# EAGLE design 128 (EAGLE 6.1)
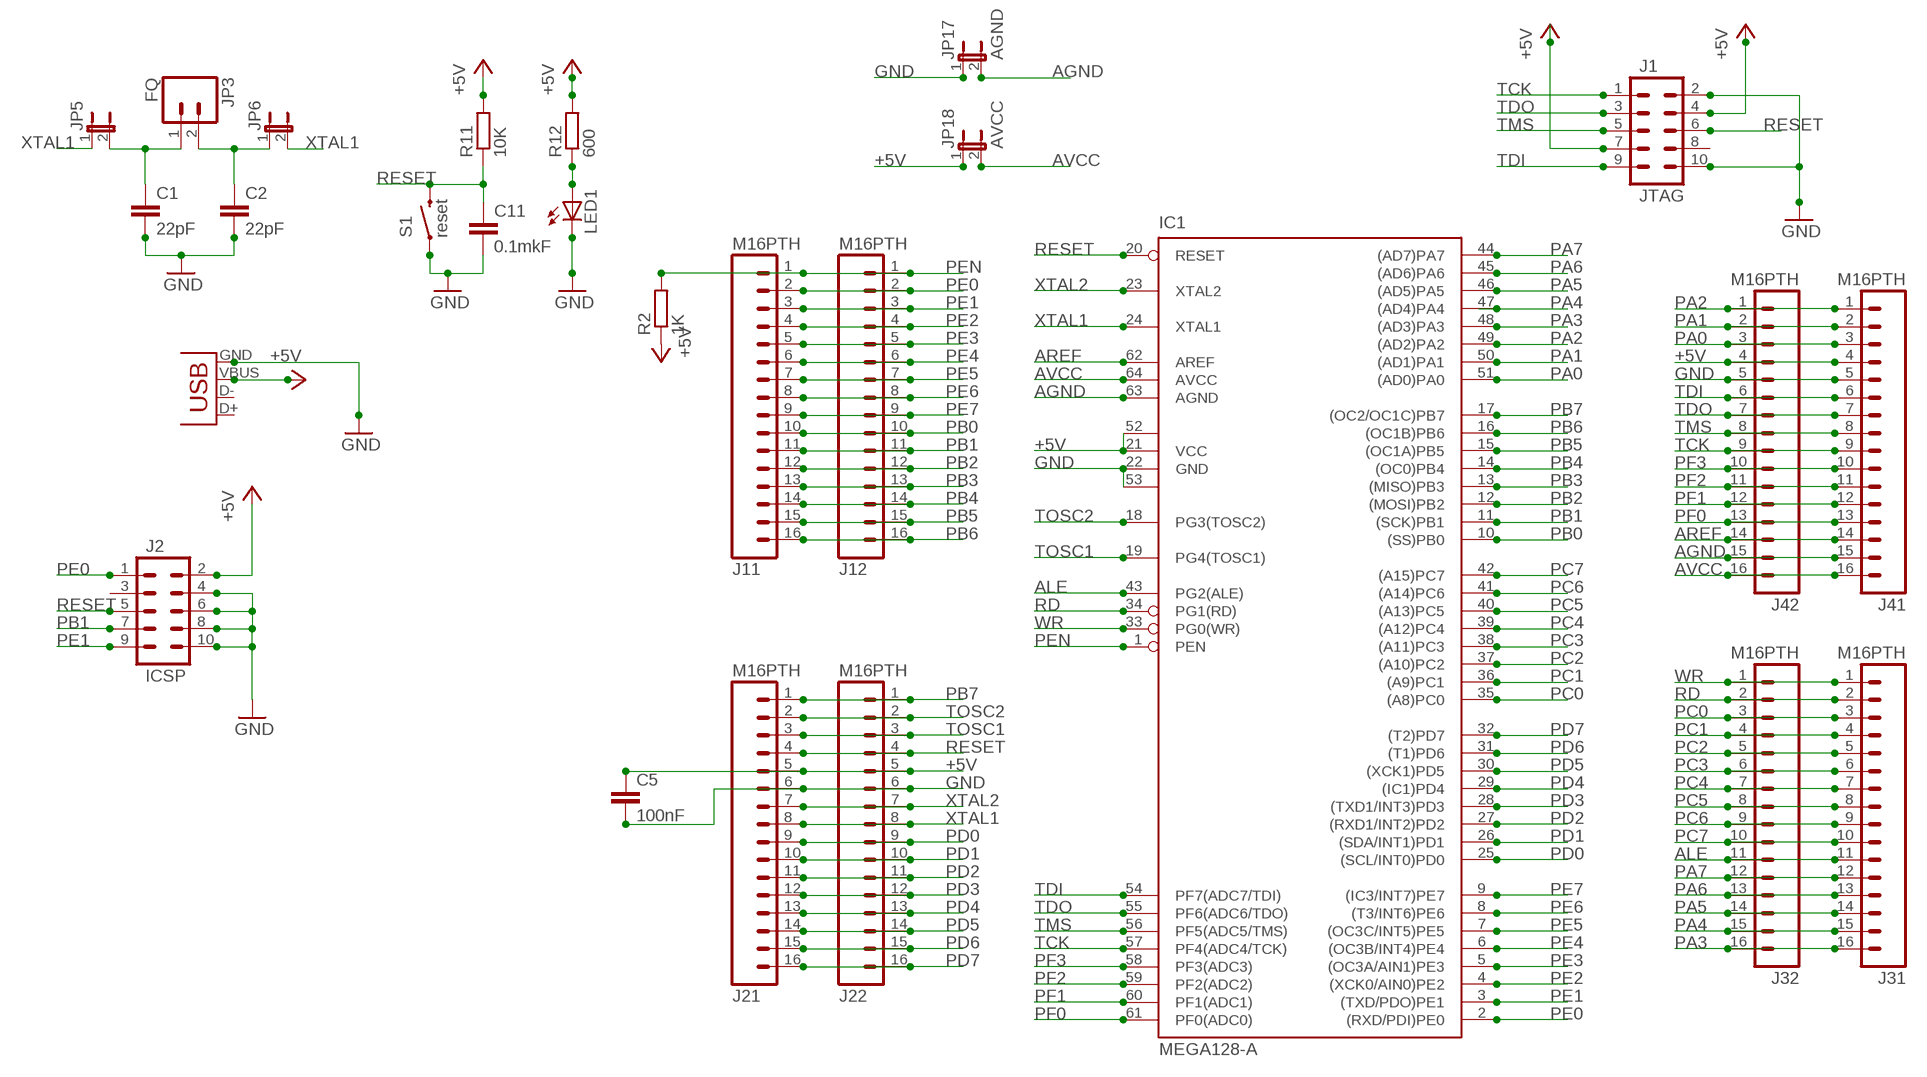
[diagram p0: schematic, sheet 1]

## Parts
C1  22pF  C-EUC0805  [C0805]
C2  22pF  C-EUC0805  [C0805]
C5  100nF  C-EUC0805  [C0805]
C11  0.1mkF  C-EUC0805  [C0805]
IC1  MEGA128-A  [TQFP64]
J1  JTAG  M05X2SHD_LOCK  [2X5-SHROUDED_LOCK]
J2  ICSP  M05X2SHD_LOCK  [2X5-SHROUDED_LOCK]
J11  M16PTH  [1X16]
J12  M16PTH  [1X16]
J21  M16PTH  [1X16]
J22  M16PTH  [1X16]
J31  M16PTH  [1X16]
J32  M16PTH  [1X16]
J41  M16PTH  [1X16]
J42  M16PTH  [1X16]
JP3  FQ  M02LOCK  [1X02_LOCK]
JP4  USBSMD  [USB-MINIB]
JP5  JUMPER-2PTH  [1X02]
JP6  JUMPER-2PTH  [1X02]
JP17  AGND  JUMPER-2PTH  [1X02]
JP18  AVCC  JUMPER-2PTH  [1X02]
LED1  LED1206  [LED-1206]
R2  1K  R-EU_R0805  [R0805]
R11  10K  R-EU_R0805  [R0805]
R12  600  R-EU_R0805  [R0805]
S1  reset  SWITCH-MOMENTARY-2SMD-2  [TACTILE_SWITCH_SMD-2]

## Nets
+5V: C5.1 IC1.21(VCC) IC1.52(VCC1) J1.4 J1.7 J2.2 J21.5 J22.5 J41.4 J42.4 JP4.VBUS JP18.1 R2.1 R11.2 R12.2
AGND: IC1.63(AGND) J41.15 J42.15 JP17.2
ALE: IC1.43(PG2(ALE)) J31.11 J32.11
AREF: IC1.62(AREF) J41.14 J42.14
AVCC: IC1.64(AVCC) J41.16 J42.16 JP18.2
GND: C1.2 C2.2 C5.2 C11.2 IC1.22(GND) IC1.53(GND1) J1.2 J1.10 J2.4 J2.6 J2.8 J2.10 J21.6 J22.6 J41.5 J42.5 JP4.GND JP17.1 LED1.C S1.2
N$65: C1.1 JP3.1 JP5.2
N$66: C2.1 JP3.2 JP6.1
N$67: LED1.A R12.1
PA0: IC1.51((AD0)PA0) J41.3 J42.3
PA1: IC1.50((AD1)PA1) J41.2 J42.2
PA2: IC1.49((AD2)PA2) J41.1 J42.1
PA3: IC1.48((AD3)PA3) J31.16 J32.16
PA4: IC1.47((AD4)PA4) J31.15 J32.15
PA5: IC1.46((AD5)PA5) J31.14 J32.14
PA6: IC1.45((AD6)PA6) J31.13 J32.13
PA7: IC1.44((AD7)PA7) J31.12 J32.12
PB0: IC1.10((SS)PB0) J11.10 J12.10
PB1: IC1.11((SCK)PB1) J2.7 J11.11 J12.11
PB2: IC1.12((MOSI)PB2) J11.12 J12.12
PB3: IC1.13((MISO)PB3) J11.13 J12.13
PB4: IC1.14((OC0)PB4) J11.14 J12.14
PB5: IC1.15((OC1A)PB5) J11.15 J12.15
PB6: IC1.16((OC1B)PB6) J11.16 J12.16
PB7: IC1.17((OC2/OC1C)PB7) J21.1 J22.1
PC0: IC1.35((A8)PC0) J31.3 J32.3
PC1: IC1.36((A9)PC1) J31.4 J32.4
PC2: IC1.37((A10)PC2) J31.5 J32.5
PC3: IC1.38((A11)PC3) J31.6 J32.6
PC4: IC1.39((A12)PC4) J31.7 J32.7
PC5: IC1.40((A13)PC5) J31.8 J32.8
PC6: IC1.41((A14)PC6) J31.9 J32.9
PC7: IC1.42((A15)PC7) J31.10 J32.10
PD0: IC1.25((SCL/INT0)PD0) J21.9 J22.9
PD1: IC1.26((SDA/INT1)PD1) J21.10 J22.10
PD2: IC1.27((RXD1/INT2)PD2) J21.11 J22.11
PD3: IC1.28((TXD1/INT3)PD3) J21.12 J22.12
PD4: IC1.29((IC1)PD4) J21.13 J22.13
PD5: IC1.30((XCK1)PD5) J21.14 J22.14
PD6: IC1.31((T1)PD6) J21.15 J22.15
PD7: IC1.32((T2)PD7) J21.16 J22.16
PE0: IC1.2((RXD/PDI)PE0) J2.1 J11.2 J12.2
PE1: IC1.3((TXD/PDO)PE1) J2.9 J11.3 J12.3
PE2: IC1.4((XCK0/AIN0)PE2) J11.4 J12.4
PE3: IC1.5((OC3A/AIN1)PE3) J11.5 J12.5
PE4: IC1.6((OC3B/INT4)PE4) J11.6 J12.6
PE5: IC1.7((OC3C/INT5)PE5) J11.7 J12.7
PE6: IC1.8((T3/INT6)PE6) J11.8 J12.8
PE7: IC1.9((IC3/INT7)PE7) J11.9 J12.9
PEN: IC1.1(PEN) J11.1 J12.1 R2.2
PF0: IC1.61(PF0(ADC0)) J41.13 J42.13
PF1: IC1.60(PF1(ADC1)) J41.12 J42.12
PF2: IC1.59(PF2(ADC2)) J41.11 J42.11
PF3: IC1.58(PF3(ADC3)) J41.10 J42.10
RD: IC1.34(PG1(RD)) J31.2 J32.2
RESET: C11.1 IC1.20(RESET) J1.6 J2.5 J21.4 J22.4 R11.1 S1.1
TCK: IC1.57(PF4(ADC4/TCK)) J1.1 J41.9 J42.9
TDI: IC1.54(PF7(ADC7/TDI)) J1.9 J41.6 J42.6
TDO: IC1.55(PF6(ADC6/TDO)) J1.3 J41.7 J42.7
TMS: IC1.56(PF5(ADC5/TMS)) J1.5 J41.8 J42.8
TOSC1: IC1.19(PG4(TOSC1)) J21.3 J22.3
TOSC2: IC1.18(PG3(TOSC2)) J21.2 J22.2
WR: IC1.33(PG0(WR)) J31.1 J32.1
XTAL1: IC1.24(XTAL1) J21.8 J22.8 JP5.1 JP6.2
XTAL2: IC1.23(XTAL2) J21.7 J22.7
Unconnected: J1.8 J2.3 JP4.D+ JP4.D-

## Library data of the parts
C1 C2 C5 C11 = resistor:C-EU: CAPACITOR, European symbol
IC1 = avr-6:MEGA128: MICROCONTROLLER 128 Kbytes FLASH 4 Kbytes SRAM 4 Kbytes EEPROM DUAL USART 8-channel 10 bit ADC
J1 J2 = SparkFun-Connectors:M05X2: Header 5x2 Standard 10-pin dual row 0.1" header. Commonly used with AVR-ISP. Use with Spark Fun Electronics SKU: PRT-00778
J11 J12 J21 J22 J31 J32 J41 J42 = SparkFun-Connectors:M16: 1x16 .1" header
JP3 = SparkFun-Connectors:M02: Standard 2-pin 0.1" header. Use with - straight break away headers ( PRT-00116) - right angle break away headers (PRT-00553) - swiss pins (PRT-00743) - machine pins (PRT-00117) - female headers (PRT-00115) Molex polarized connector foot print use with: PRT-08233 with associated crimp pins and housings. 2.54_SCREWTERM for use with PRT-10571. 3.5mm Screw Terminal footprints for PRT-08084 5mm Screw Terminal footprints for use with PRT-08433
JP4 = SparkFun-Connectors:USB: USB Connectors USB-B-PTH is fully proven SKU : PRT-00139/CONN-08278 USB-miniB is fully proven SKU : PRT-00587 USB-A-PCB is untested. USB-A-H is throughly reviewed, but untested. Spark Fun Electronics SKU : PRT-00437 USB-B-SMT is throughly reviewed, but untested. Needs silkscreen touching up. USB-A-S has not been used/tested USB-MB-H has not been used/tested USB-MICROB has been used. CONN-09505; PROD_ID: CONN-08193
JP5 JP6 JP17 JP18 = SparkFun-Passives:JUMPER-2: Jumper Basic 0.1" spaced jumper. Use with breakaway headers.
LED1 = SparkFun-LED:LED: LEDs Standard schematic elements and footprints for 5mm, 3mm, 1206, and 0603 sized LEDs. 5mm - Spark Fun Electronics SKU : COM-00529 (and others)
R2 R11 R12 = resistor:R-EU_: RESISTOR, European symbol
S1 = SparkFun-Electromechanical:SWITCH-MOMENTARY-2: Various NO switches- pushbuttons, reed, etc

## Board
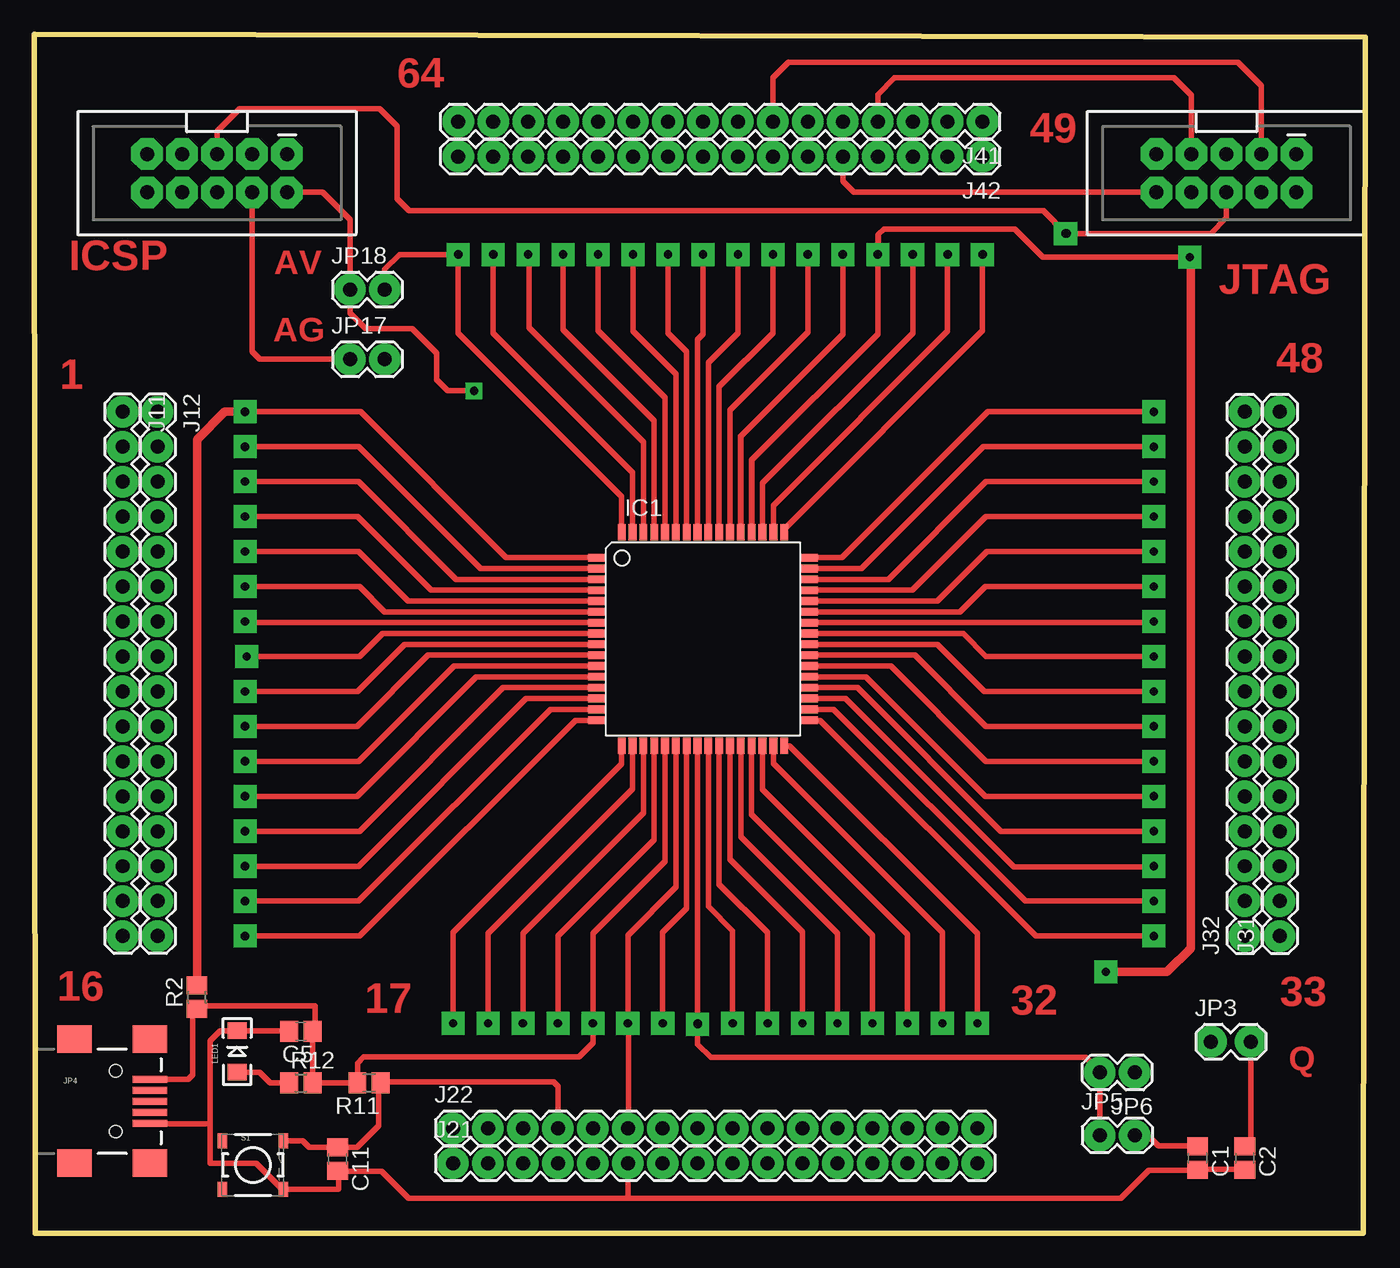
[diagram p1: board, top side]
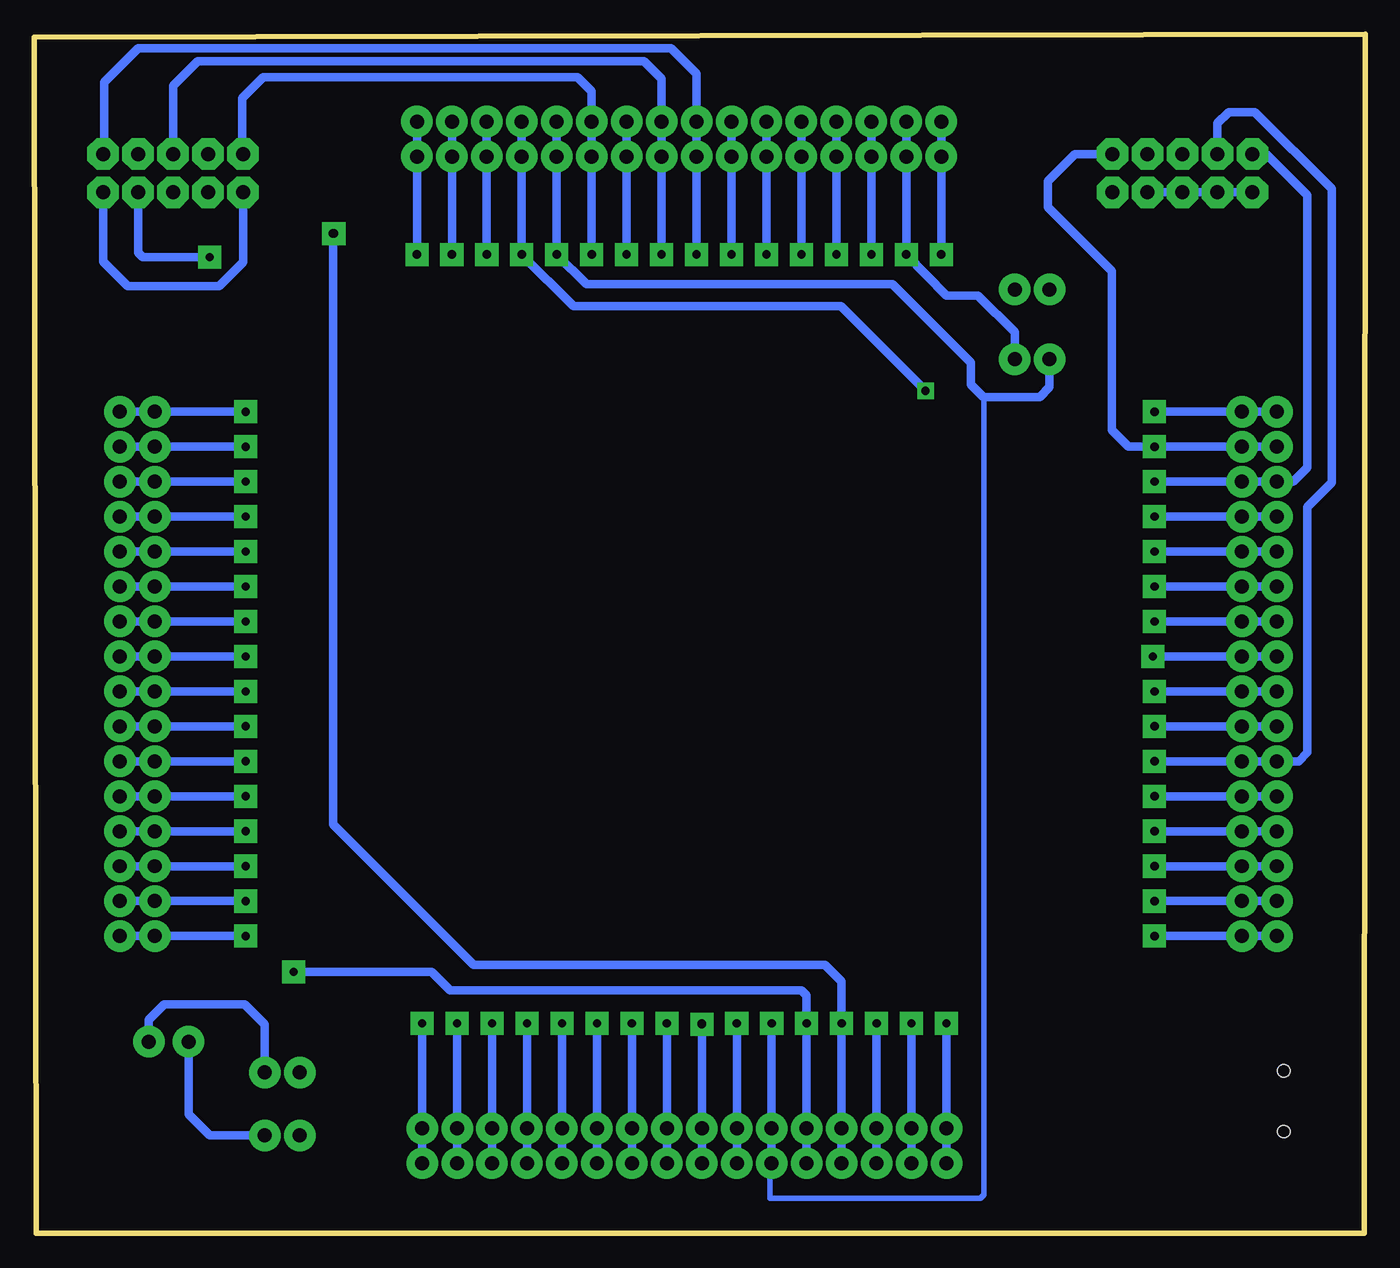
[diagram p2: board, bottom side, seen from below]

Size 96.69 x 87.11 mm. Coordinates in mm from the lower left corner, seen from the top.
Outline: 0.06,0 96.56,0 96.69,86.92 0,87.11 0.06,0
Copper layers (1*16): Top 0.035mm / dielectric 1.5mm / Bottom 0.035mm
Design rules: minimum track width 10mil, minimum drill 12mil, track to track 8mil, track to pad 12mil, pad to pad 12mil, via to via 12mil, smd to smd 8mil, copper to edge 4mil, drill to drill 20mil, minimum pad ring 25mil, minimum via ring 12mil, stop-mask expansion 4mil, vias tented up to drill 0mil, thermal gap 10mil

### Footprints (pad centres in the part's own frame; a part is rotated, then mirrored left to right if it is on the bottom)
C0805 = smd 1.3 x 1.5: 1 -0.85,0; 2 0.85,0
TQFP64 = smd 1.194 x 0.559: 1 -7.76,5.905; 2 -7.76,5.118; 3 -7.76,4.331; 4 -7.76,3.543; 5 -7.76,2.756; 6 -7.76,1.968; 7 -7.76,1.181; 8 -7.76,0.394; 9 -7.76,-0.394; 10 -7.76,-1.181; 11 -7.76,-1.968; 12 -7.76,-2.756; 13 -7.76,-3.543; 14 -7.76,-4.331; 15 -7.76,-5.118; 16 -7.76,-5.905; 33 7.76,-5.905; 34 7.76,-5.118; 35 7.76,-4.331; 36 7.76,-3.543; 37 7.76,-2.756; 38 7.76,-1.968; 39 7.76,-1.181; 40 7.76,-0.394; 41 7.76,0.394; 42 7.76,1.181; 43 7.76,1.968; 44 7.76,2.756; 45 7.76,3.543; 46 7.76,4.331; 47 7.76,5.118; 48 7.76,5.905 | smd 0.559 x 1.194: 17 -5.905,-7.76; 18 -5.118,-7.76; 19 -4.331,-7.76; 20 -3.543,-7.76; 21 -2.756,-7.76; 22 -1.968,-7.76; 23 -1.181,-7.76; 24 -0.394,-7.76; 25 0.394,-7.76; 26 1.181,-7.76; 27 1.968,-7.76; 28 2.756,-7.76; 29 3.543,-7.76; 30 4.331,-7.76; 31 5.118,-7.76; 32 5.905,-7.76; 49 5.905,7.76; 50 5.118,7.76; 51 4.331,7.76; 52 3.543,7.76; 53 2.756,7.76; 54 1.968,7.76; 55 1.181,7.76; 56 0.394,7.76; 57 -0.394,7.76; 58 -1.181,7.76; 59 -1.968,7.76; 60 -2.756,7.76; 61 -3.543,7.76; 62 -4.331,7.76; 63 -5.118,7.76; 64 -5.905,7.76
2X5-SHROUDED_LOCK = drill 1.016 pad 1.88 octagon: 1 -1.397,5.08; 2 1.397,5.08; 3 -1.397,2.54; 4 1.397,2.54; 5 -1.397,0; 6 1.397,0; 7 -1.397,-2.54; 8 1.397,-2.54; 9 -1.397,-5.08; 10 1.397,-5.08
1X16 = drill 1.016 pad 1.88: 1 0,0; 2 2.54,0; 3 5.08,0; 4 7.62,0; 5 10.16,0; 6 12.7,0; 7 15.24,0; 8 17.78,0; 9 20.32,0; 10 22.86,0; 11 25.4,0; 12 27.94,0; 13 30.48,0; 14 33.02,0; 15 35.56,0; 16 38.1,0
1X02_LOCK = drill 1.016 pad 1.88: 1 -0.178,0; 2 2.718,0
USB-MINIB = smd 2.5 x 0.5: D+ 2.5,0; D- 2.5,0.8; GND 2.5,-1.6; ID 2.5,-0.8; VBUS 2.5,1.6 | smd 2.5 x 2: MTN1 -3,4.5; MTN2 2.5,4.5; MTN3 -3,-4.5; MTN4 2.5,-4.5 | hole 0.9: 0,2.2; 0,-2.2
1X02 = drill 1.016 pad 1.88: 1 0,0; 2 2.54,0
LED-1206 = smd 1.2 x 1.4: A -1.5,0; C 1.5,0
R0805 = smd 1.3 x 1.5: 1 -0.85,0; 2 0.85,0
TACTILE_SWITCH_SMD-2 = smd 0.7 x 1.1: 1 2.225,1.75; 2 2.225,-1.75; 3 -2.225,-1.75; 4 -2.225,1.75

### Placement (x,y rotation side)
C1  84.52,5.46 270 top
C2  87.95,5.46 270 top
C5  19.37,14.67 180 top
C11  22.03,5.4 270 top
IC1  48.58,43.18 0 top
J1  86.61,77.03 270 top
J2  13.27,77.03 270 top
J11  6.41,59.69 270 top
J12  8.95,59.69 270 top
J21  30.42,5.08 0 top
J22  30.42,7.62 0 top
J31  90.49,21.59 90 top
J32  87.95,21.59 90 top
J41  68.9,80.77 180 top
J42  68.9,78.23 180 top
JP3  85.66,13.91 0 top
JP4  5.91,9.59 0 top
JP5  77.41,7.11 0 top
JP6  79.95,11.68 180 top
JP17  22.92,63.5 0 top
JP18  22.92,68.58 0 top
LED1  14.73,13.21 90 top
R2  11.81,17.14 90 top
R11  24.32,10.92 180 top
R12  19.37,10.92 0 top
S1  15.88,4.95 0 top

### Tracks (layer width: path | path; a pad name or v marks a point on that pad's centre or on a via)
+5V  (via drill 0.6, 0.6 pad 1.68)
  Top 0.254: 11.49,16.51 R2.1 | 20.38,15.24 C5.1 | 40.7,15.24 v40.58,15.24 | 45.85,35.56 IC1.21 | 52.07,50.74 IC1.52
  Top 0.406: IC1.52 52.12,56.19 52.13,56.2 | 61.28,71.06 v61.28,71.12 61.28,72.52 61.34,72.58 | 20.38,15.24 20.38,16.51 11.49,16.51 11.49,11.49 11.18,11.18 8.42,11.18 JP4.VBUS | C5.1 R12.2 R11.2 23.47,12.36 23.94,12.83 39.56,12.83 40.58,13.84 v40.58,15.24 40.58,21.78 45.82,27.03 IC1.21 | 52.2,50.86 IC1.52 | J2.2 20.96,75.63 22.92,73.66 JP18.1 22.92,66.86 24.07,65.72 27.43,65.72 29.21,63.94 29.21,62.04 30.04,61.21 v31.94,61.21 | J1.7 84.07,82.68 82.8,83.95 62.48,83.95 61.28,82.74 61.28,80.83 J41.4 | 52.13,50.93 IC1.52 | 52.07,50.74 52.07,50.98 52.15,51.05 52.15,51.28 | 52.15,51.36 52.15,51.4 52.11,51.44 52.11,51.32 52.15,51.28 | 52.15,51.28 52.15,51.36 | 52.15,51.36 52.13,51.37 52.13,56.2 | 52.13,56.2 61.28,65.34 61.28,71.06 | 61.28,71.06 61.34,71.12 61.34,72.58 | 61.34,72.58 61.72,72.96 71.25,72.96 73.28,70.93 v83.95,70.93 84.01,70.93
  Top 0.61: 84.01,70.93 84.01,20.7 82.3,18.99 v77.85,18.99 | 61.28,80.83 61.28,78.17 | 40.58,7.68 J21.5
  Bottom 0.61: J21.5 J22.5 v40.58,15.24 40.58,17.27 40.96,17.65 66.48,17.65 67.82,18.99 v77.85,18.99 | J41.4 J42.4 v61.28,71.12 | 61.12,70.96 v61.28,71.12 | v83.95,70.93 88.84,70.93 89.15,71.25 J1.4 | v31.94,61.21 38.1,67.37 57.53,67.37 v61.28,71.12
AGND  (via drill 0.6 pad 1.68)
  Top 0.406: IC1.63 43.46,55.28 33.34,65.41 v33.34,71.12
  Top 0.61: 33.34,78.17 J41.15
  Bottom 0.61: J41.15 J42.15 v33.34,71.12 30.42,68.14 28.13,68.14 25.46,65.47 JP17.2
ALE  (via drill 0.6 pad 1.68)
  Top 0.406: IC1.43 67.25,45.15 69.09,46.99 v81.34,46.99
  Top 0.61: 87.82,46.99 J31.11
  Bottom 0.61: J31.11 J32.11 v81.34,46.99
AREF  (via drill 0.6 pad 1.68)
  Top 0.406: IC1.62 44.25,57.48 35.94,65.79 35.94,71.06 v35.88,71.12
  Bottom 0.61: J41.14 J42.14 v35.88,71.12
AVCC  (via drill 0.6 pad 1.68)
  Top 0.406: IC1.64 42.67,53.53 30.8,65.41 v30.8,71.12 26.54,71.12 25.46,70.04 JP18.2
  Top 0.61: J41.16 30.8,78.17
  Bottom 0.61: J41.16 J42.16 v30.8,71.12
GND  (via drill 0.6 pad 1.68)
  Top 0.254: 85.15,5.08 C1.2 83.88,5.08 | 21.65,5.08 C11.2 | 51.31,50.8 IC1.53 | 12.76,9.72 12.76,9.53
  Top 0.406: 51.33,57.94 IC1.53 51.31,50.91 | 51.33,57.94 58.74,65.34 v58.74,71.12 | 43.12,15.37 v43.12,15.24 | 43.18,2.54 27.18,2.54 25.23,4.48 22.1,4.48 | 43.18,2.54 78.93,2.54 80.96,4.57 84.48,4.57 C1.2 84.54,4.64 87.5,4.64 87.69,4.83 87.95,4.83 C2.2 | C5.2 18.48,14.71 LED1.C 13.5,14.71 12.76,13.97 12.76,9.72 12.76,9.59 | 22.1,4.48 22.1,3.24 22.06,3.2 S1.2 18.14,3.24 18.16,3.24 18.1,3.3 17.97,3.3 17.97,3.24 16.13,5.08 12.76,5.08 12.76,7.94 | 22.1,4.48 C11.2 | J21.6 43.12,2.6 43.18,2.54 | J1.10 59.56,75.63 58.74,76.45 58.74,78.17 J42.5 | J2.4 15.81,64.07 16.38,63.5 JP17.1 | 12.76,7.94 8.51,7.94 8.45,8 8.42,8 JP4.GND | 12.76,7.94 12.76,9.53 | IC1.22 46.61,25.15 43.12,21.65 43.12,15.37 | 43.12,15.37 43.18,15.3 43.18,4.83 | 51.31,50.8 51.31,57.91 51.33,57.94
  Top 0.61: 58.74,80.83 58.74,78.17 | J22.6 J21.6
  Bottom 0.406: 28.64,63.25 28.64,61.66 | v58.74,71.12 58.67,71.12 56.52,68.96 34.42,68.96 34.35,68.9 34.29,68.9 28.58,63.18 28.58,61.59 27.69,60.71 27.69,2.79 27.94,2.54 43.24,2.54 43.24,4.45 43.12,4.57 J21.6
  Bottom 0.61: J21.6 J22.6 v43.12,15.24 | J41.5 J42.5 v58.74,71.12 | J2.4 J2.6 J2.8 J2.10 | J1.10 81.53,70.55 83.25,68.83 89.92,68.83 91.69,70.61 J1.2 | 58.64,71.03 v58.74,71.12 | 28.64,61.72 28.64,63.25 34.35,68.96 56.52,68.96 56.58,68.96 v58.74,71.12 | 28.64,61.66 27.75,60.77 23.62,60.77 22.92,61.47 JP17.1
N$1
  Top 0.61: 6.35,34.29 9.02,34.29
N$2
  Top 0.61: 6.35,57.15 9.02,57.15
N$4
  Top 0.61: 35.88,80.83 35.88,78.17
N$5
  Top 0.61: 38.42,80.83 38.42,78.17
N$6
  Top 0.61: 40.96,80.9 40.96,78.17
N$7
  Top 0.61: 43.5,80.83 43.5,78.17
N$8
  Top 0.61: 48.58,80.83 48.58,78.17
N$9
  Top 0.61: 51.12,80.83 51.12,78.17
N$10
  Top 0.61: 56.2,80.9 56.2,78.17
N$11
  Top 0.61: 63.82,80.83 63.82,78.17
N$12
  Top 0.61: 87.88,24.13 90.55,24.13
N$13
  Top 0.61: 30.42,5.14 30.42,7.68
N$65
  Top 0.406: JP5.2 80.9,7.11 81.66,6.35 84.45,6.35 84.45,6.31 | C1.1 84.45,6.31 | 84.45,6.31 84.45,6.29
  Bottom 0.61: JP3.1 85.48,8.65 83.95,7.11 JP5.2
N$66
  Top 0.406: C2.1 88.1,6.31 88.39,6.6 88.39,13.89 JP3.2
  Bottom 0.61: JP6.1 79.95,15.18 81.41,16.64 87.25,16.64 88.39,15.49 JP3.2
N$67
  Top 0.406: R12.1 17.14,10.92 16.38,11.68 14.8,11.68 | 14.8,11.68 14.6,11.68 | LED1.A 14.77,11.71 14.8,11.68
PA0  (via drill 0.6 pad 1.68)
  Top 0.406: IC1.51 52.91,54.5 63.82,65.41 v63.82,71.12
  Bottom 0.61: J41.3 J42.3 v63.82,71.12
PA1  (via drill 0.6 pad 1.68)
  Top 0.406: IC1.50 53.7,52.87 66.36,65.53 v66.36,71.12
  Top 0.61: J41.2 66.36,78.17
  Bottom 0.61: J41.2 J42.2 v66.36,71.12
PA2  (via drill 0.6 pad 1.68)
  Top 0.406: IC1.49 54.48,51.18 68.9,65.6 v68.9,71.12
  Top 0.61: J41.1 68.9,78.17
  Bottom 0.61: J41.1 J42.1 v68.9,71.12
PA3  (via drill 0.6 pad 1.68)
  Top 0.406: IC1.48 58.67,49.09 69.28,59.69 v81.34,59.69
  Top 0.61: 87.88,59.69 J31.16
  Bottom 0.61: J31.16 J32.16 v81.34,59.69
PA4  (via drill 0.6 pad 1.68)
  Top 0.406: IC1.47 60.11,48.3 68.96,57.15 v81.34,57.15
  Top 0.61: 87.88,57.15 J31.15
  Bottom 0.61: J31.15 J32.15 v81.34,57.15
PA5  (via drill 0.6 pad 1.68)
  Top 0.406: IC1.46 62.05,47.51 69.15,54.61 v81.34,54.61
  Top 0.61: 87.88,54.61 J31.14
  Bottom 0.61: J31.14 J32.14 v81.34,54.61
PA6  (via drill 0.6 pad 1.68)
  Top 0.406: IC1.45 63.8,46.72 69.15,52.07 v81.34,52.07
  Top 0.61: 87.88,52.07 J31.13
  Bottom 0.61: J31.13 J32.13 v81.34,52.07
PA7  (via drill 0.6 pad 1.68)
  Top 0.406: IC1.44 65.62,45.94 69.21,49.53 v81.34,49.53
  Top 0.61: 87.88,49.53 J31.12
  Bottom 0.61: J31.12 J32.12 v81.34,49.53
PB0  (via drill 0.6 pad 1.68)
  Top 0.406: IC1.10 28.6,42 23.43,36.83 v15.3,36.83
  Top 0.61: J11.10 9.02,36.83
  Bottom 0.61: J11.10 J12.10 v15.3,36.83
PB1  (via drill 0.6 pad 1.68)
  Top 0.406: IC1.11 30.48,41.21 23.56,34.29 v15.3,34.29
  Bottom 0.61: v15.3,34.29 J12.11 J11.11 4.83,34.29 4.19,34.92 4.19,52.77 2.41,54.55 2.41,75.88 8,81.47 9.91,81.47 10.73,80.64 J2.7
PB2  (via drill 0.6 pad 1.68)
  Top 0.406: IC1.12 32.11,40.42 23.43,31.75 v15.3,31.75
  Top 0.61: J11.12 9.02,31.75
  Bottom 0.61: J11.12 J12.12 v15.3,31.75
PB3  (via drill 0.6 pad 1.68)
  Top 0.406: IC1.13 34.05,39.64 23.62,29.21 v15.3,29.21
  Top 0.61: J11.13 9.02,29.21
  Bottom 0.61: J11.13 J12.13 v15.3,29.21
PB4  (via drill 0.6 pad 1.68)
  Top 0.406: IC1.14 35.74,38.85 23.56,26.67 v15.3,26.67
  Top 0.61: J11.14 9.02,26.67
  Bottom 0.61: J11.14 J12.14 v15.3,26.67
PB5  (via drill 0.6 pad 1.68)
  Top 0.406: IC1.15 37.49,38.06 23.56,24.13 v15.3,24.13
  Top 0.61: J11.15 9.02,24.13
  Bottom 0.61: J11.15 J12.15 v15.3,24.13
PB6  (via drill 0.6 pad 1.68)
  Top 0.406: IC1.16 39.31,37.27 23.62,21.59 v15.3,21.59
  Top 0.61: J11.16 J12.16
  Bottom 0.61: J11.16 J12.16 v15.3,21.59
PB7  (via drill 0.6 pad 1.68)
  Top 0.406: IC1.17 42.67,34.1 30.42,21.84 v30.42,15.24
  Bottom 0.61: J21.1 J22.1 v30.42,15.24
PC0  (via drill 0.6 pad 1.68)
  Top 0.406: IC1.35 58.94,38.85 71.18,26.61 81.28,26.61 v81.34,26.67
  Top 0.61: J32.3 J31.3
  Bottom 0.61: J31.3 J32.3 v81.34,26.67
PC1  (via drill 0.6 pad 1.68)
  Top 0.406: IC1.36 59.8,39.64 70.23,29.21 v81.34,29.21
  Top 0.61: 87.88,29.21 J31.4
  Bottom 0.61: J31.4 J32.4 v81.34,29.21
PC2  (via drill 0.6 pad 1.68)
  Top 0.406: IC1.37 60.41,40.42 69.09,31.75 v81.34,31.75
  Top 0.61: 87.88,31.75 J31.5
  Bottom 0.61: J31.5 J32.5 v81.34,31.75
PC3  (via drill 0.6 pad 1.68)
  Top 0.406: IC1.38 62.23,41.21 69.15,34.29 v81.34,34.29
  Top 0.61: J32.6 J31.6
  Bottom 0.61: J31.6 J32.6 v81.34,34.29
PC4  (via drill 0.6 pad 1.68)
  Top 0.406: IC1.39 63.98,42 69.15,36.83 v81.34,36.83
  Top 0.61: J32.7 J31.7
  Bottom 0.61: J31.7 J32.7 v81.34,36.83
PC5  (via drill 0.6 pad 1.68)
  Top 0.406: IC1.40 65.61,42.79 69.02,39.37 v81.34,39.37
  Top 0.61: 87.88,39.37 J31.8
  Bottom 0.61: J31.8 J32.8 v81.34,39.37
PC6  (via drill 0.6 pad 1.68)
  Top 0.406: IC1.41 67.49,43.57 69.15,41.91 v81.34,41.91
  Top 0.61: 87.88,41.91 J31.9
  Bottom 0.61: J31.9 J32.9 v81.34,41.91
PC7  (via drill 0.6 pad 1.68)
  Top 0.406: IC1.42 81.38,44.36 v81.34,44.45
  Top 0.61: 87.82,44.45 J31.10
  Bottom 0.61: J31.10 J32.10 v81.34,44.45
PD0  (via drill 0.6 pad 1.68)
  Top 0.406: IC1.25 48.97,23.74 50.74,21.97 v50.74,15.24
  Top 0.61: J22.9 J21.9
  Bottom 0.61: J21.9 J22.9 v50.74,15.24
PD1  (via drill 0.6 pad 1.68)
  Top 0.406: IC1.26 49.76,25.36 53.28,21.84 v53.28,15.24
  Top 0.61: J22.10 J21.10
  Bottom 0.61: J21.10 J22.10 v53.28,15.24
PD2  (via drill 0.6 pad 1.68)
  Top 0.406: IC1.27 50.55,27.18 55.82,21.91 v55.82,15.24
  Top 0.61: J22.11 J21.11
  Bottom 0.61: J21.11 J22.11 v55.82,15.24
PD3  (via drill 0.6 pad 1.68)
  Top 0.406: IC1.28 51.33,28.8 58.36,21.78 v58.36,15.24
  Top 0.61: J22.12 J21.12
  Bottom 0.61: J21.12 J22.12 v58.36,15.24
PD4  (via drill 0.6 pad 1.68)
  Top 0.406: IC1.29 52.12,30.43 60.9,21.65 v60.9,15.24
  Top 0.61: J22.13 J21.13
  Bottom 0.61: J21.13 J22.13 v60.9,15.24
PD5  (via drill 0.6 pad 1.68)
  Top 0.406: IC1.30 52.91,32.24 63.44,21.72 v63.44,15.24
  Top 0.61: J22.14 J21.14
  Bottom 0.61: J21.14 J22.14 v63.44,15.24
PD6  (via drill 0.6 pad 1.68)
  Top 0.406: IC1.31 53.7,34.12 65.98,21.84 v65.98,15.24
  Top 0.61: J22.15 J21.15
  Bottom 0.61: J21.15 J22.15 v65.98,15.24
PD7  (via drill 0.6 pad 1.68)
  Top 0.406: v68.52,15.24 68.52,21.78 54.88,35.42 IC1.32
  Top 0.61: J22.16 J21.16
  Bottom 0.61: J21.16 J22.16 v68.52,15.24
PE0  (via drill 0.6 pad 1.68)
  Top 0.406: IC1.2 32.41,48.3 23.56,57.15 v15.3,57.15
  Bottom 0.61: J11.2 J12.2 v15.3,57.15 17.21,57.15 18.42,58.36 18.42,69.91 23.05,74.55 23.05,76.45 21.08,78.42 J2.1
PE1  (via drill 0.6 pad 1.68)
  Top 0.406: IC1.3 30.66,47.51 23.56,54.61 v15.3,54.61
  Top 0.61: J11.3 9.02,54.61
  Bottom 0.61: v15.3,54.61 J12.3 J11.3 5.21,54.61 4.19,55.63 4.19,75.44 7.18,78.42 J2.9
PE2  (via drill 0.6 pad 1.68)
  Top 0.406: IC1.4 28.84,46.72 23.49,52.07 v15.3,52.07
  Top 0.61: J11.4 9.02,52.07
  Bottom 0.61: J11.4 J12.4 v15.3,52.07
PE3  (via drill 0.6 pad 1.68)
  Top 0.406: IC1.5 27.15,45.94 23.56,49.53 v15.3,49.53
  Top 0.61: J11.5 9.02,49.53
  Bottom 0.61: J11.5 J12.5 v15.3,49.53
PE4  (via drill 0.6 pad 1.68)
  Top 0.406: IC1.6 25.46,45.15 23.62,46.99 v15.3,46.99
  Top 0.61: J11.6 9.02,46.99
  Bottom 0.61: J11.6 J12.6 v15.3,46.99
PE5  (via drill 0.6 pad 1.68)
  Top 0.406: IC1.7 15.39,44.36 v15.3,44.45
  Top 0.61: J11.7 9.02,44.45
  Bottom 0.61: J11.7 J12.7 v15.3,44.45
PE6  (via drill 0.6 pad 1.68)
  Top 0.406: IC1.8 25.29,43.57 23.62,41.91 v15.43,41.91
  Top 0.61: J11.8 J12.8
  Bottom 0.61: J11.8 J12.8 v15.43,41.91
PE7  (via drill 0.6 pad 1.68)
  Top 0.406: IC1.9 26.91,42.79 23.49,39.37 v15.3,39.37
  Top 0.61: J11.9 9.02,39.37
  Bottom 0.61: J11.9 J12.9 v15.3,39.37
PEN  (via drill 0.6 pad 1.68)
  Top 0.254: 11.49,17.78 R2.2
  Top 0.406: v15.3,59.69 23.69,59.69 34.29,49.09 IC1.1
  Top 0.61: J11.1 9.02,59.69 | v15.3,59.69 13.84,59.69 11.81,57.66 R2.2
  Bottom 0.61: J11.1 J12.1 v15.3,59.69
PF0  (via drill 0.6 pad 1.68)
  Top 0.406: IC1.61 45.03,59.04 38.42,65.66 v38.42,71.12
  Bottom 0.61: J41.13 J42.13 v38.42,71.12
PF1  (via drill 0.6 pad 1.68)
  Top 0.406: IC1.60 45.82,60.73 40.96,65.6 v40.96,71.12
  Bottom 0.61: J41.12 J42.12 v40.96,71.12
PF2  (via drill 0.6 pad 1.68)
  Top 0.406: IC1.59 46.61,62.42 43.5,65.53 v43.5,71.12
  Bottom 0.61: J41.11 J42.11 v43.5,71.12
PF3  (via drill 0.6 pad 1.68)
  Top 0.406: IC1.58 47.4,64.05 46.04,65.41 v46.04,71.12
  Top 0.61: J41.10 46.04,78.17
  Bottom 0.61: J41.10 J42.10 v46.04,71.12
RD  (via drill 0.6 pad 1.68)
  Top 0.406: IC1.34 58.08,38.06 72.01,24.13 v81.34,24.13
  Bottom 0.61: J31.2 J32.2 v81.34,24.13
RESET  (via drill 0.6, 0.6 pad 1.68)
  Top 0.406: v38.04,15.24 38.04,21.59 45.03,28.59 IC1.20 45.02,35.43 | S1.1 18.13,6.73 19.49,6.73 19.98,6.25 C11.1 23.46,6.25 25.02,7.81 25.02,10.73 | J1.6 86.61,73.79 85.47,72.64 v74.99,72.64 | J2.5 13.27,80.07 14.92,81.72 25.08,81.72 26.35,80.45 26.35,75.18 27.24,74.3 73.28,74.3 | 25.02,10.73 25.02,10.77 R11.1 | v74.99,72.64 v74.93,72.64 73.28,74.3 | 25.02,10.73 25.27,10.99 37.72,10.99 38.04,10.67 J22.4 | 73.28,74.3 73.34,74.3 v74.99,72.64
  Top 0.61: J22.4 J21.4
  Bottom 0.61: J21.4 J22.4 v38.04,15.24 38.04,18.29 39.24,19.49 64.77,19.49 74.99,29.72 v74.99,72.64
TCK  (via drill 0.6 pad 1.68)
  Top 0.406: IC1.57 48.18,64.95 48.58,65.34 v48.58,71.12
  Bottom 0.61: J41.9 J42.9 | J42.9 v48.58,71.12 | J42.9 48.58,84.26 50.42,86.11 89.15,86.11 91.63,83.63 91.63,78.49 J1.1
TDI  (via drill 0.6 pad 1.68)
  Top 0.406: IC1.54 50.55,59.82 56.2,65.47 v56.2,71.12
  Bottom 0.61: v56.2,71.12 J42.6 J41.6 56.2,83 57.21,84.01 80.07,84.01 81.6,82.49 81.6,78.49 J1.9
TDO  (via drill 0.6 pad 1.68)
  Top 0.406: IC1.55 49.76,61.51 53.66,65.41 v53.66,71.12 | J42.7 J41.7 53.66,83.95 54.8,85.09 87.44,85.09 89.15,83.38 J1.3
  Top 0.61: J41.7 53.66,78.17
  Bottom 0.61: J41.7 J42.7 v53.66,71.12
TMS  (via drill 0.6 pad 1.68)
  Top 0.406: IC1.56 48.97,63.26 51.12,65.41 v51.12,71.12
  Bottom 0.61: J41.8 J42.8 | J42.8 v51.12,71.12 | J42.8 51.12,83.88 52.39,85.15 84.84,85.15 86.61,83.38 J1.5
TOSC1  (via drill 0.6 pad 1.68)
  Top 0.406: IC1.19 44.25,30.53 35.5,21.78 v35.5,15.24
  Top 0.61: 35.5,7.75 J21.3
  Bottom 0.61: J21.3 J22.3 v35.5,15.24
TOSC2  (via drill 0.6 pad 1.68)
  Top 0.406: IC1.18 43.46,32.28 32.96,21.78 v32.96,15.24
  Top 0.61: 32.96,7.75 J21.2
  Bottom 0.61: J21.2 J22.2 v32.96,15.24
WR  (via drill 0.6 pad 1.68)
  Top 0.406: IC1.33 57.09,37.27 72.77,21.59 v81.34,21.59
  Top 0.61: J32.1 J31.1
  Bottom 0.61: J31.1 J32.1 v81.34,21.59
XTAL1  (via drill 0.6 pad 1.42, 0.6 pad 1.68)
  Top 0.406: IC1.24 48.18,15.25 v48.2,15.24 | JP5.1 JP6.2 77.41,11.75 76.39,12.76 49.15,12.76 48.2,13.72 v48.2,15.18
  Top 0.61: 48.2,7.68 J21.8
  Bottom 0.61: J21.8 J22.8 v48.2,15.18 | v48.2,15.18 v48.2,15.24 | 48.32,15.05 v48.2,15.18
XTAL2  (via drill 0.6 pad 1.68)
  Top 0.406: IC1.23 47.4,23.58 45.66,21.84 v45.66,15.24
  Top 0.61: 45.66,7.68 J21.7
  Bottom 0.61: J21.7 J22.7 v45.66,15.24

### Text on the board
Top: 64 | 49 | ICSP | AV | JTAG | AG | 48 | 1 | 16 | 33 | 17 | 32 | Q